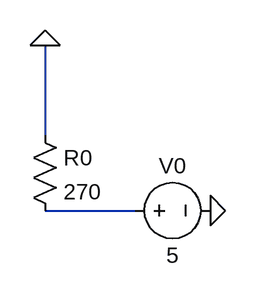
[diagram p0: schematic output.asc]
output.asc, the LTspice schematic file:
Version 4
SHEET 1 880 680
WIRE 0 0 0 96
WIRE 0 176 96 176
FLAG 176 176 0
FLAG 0 0 0
SYMBOL res -16 80 R0
SYMATTR InstName R0
SYMATTR Value 270
SYMBOL voltage 80 176 R270
SYMATTR InstName V0
SYMATTR Value 5
WINDOW 0 32 56 VTop 2
WINDOW 3 -32 56 VBottom 2
WINDOW 123 0 0 VLeft 0
WINDOW 39 0 0 VLeft 0

The netlist it stands for:
* output.asc
R0 0 N001 270
V0 N001 0 5
.backanno
.end